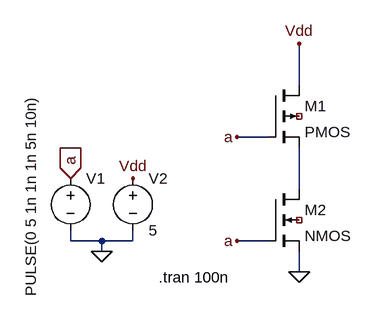
[diagram p0: schematic NOT.asc]
NOT.asc, the LTspice schematic file:
Version 4
SHEET 1 880 680
WIRE 560 64 560 0
WIRE 512 144 464 144
WIRE 560 224 560 160
WIRE 208 304 208 288
WIRE 256 304 208 304
WIRE 304 304 304 288
WIRE 304 304 256 304
WIRE 512 304 464 304
WIRE 256 320 256 304
WIRE 560 352 560 320
FLAG 208 208 a
IOPIN 208 208 In
FLAG 304 208 Vdd
FLAG 256 320 0
FLAG 560 352 0
FLAG 464 144 a
FLAG 464 304 a
FLAG 560 0 Vdd
SYMBOL voltage 208 192 R0
WINDOW 3 -61 -113 VRight 2
SYMATTR InstName V1
SYMATTR Value PULSE(0 5 1n 1n 1n 5n 10n)
SYMBOL voltage 304 192 R0
SYMATTR InstName V2
SYMATTR Value 5
SYMBOL pmos4 512 64 R0
SYMATTR InstName M1
SYMBOL nmos4 512 224 R0
SYMATTR InstName M2
TEXT 344 360 Left 2 !.tran 100n

The netlist it stands for:
* NOT.asc
V1 a 0 PULSE(0 5 1n 1n 1n 5n 10n)
V2 Vdd 0 5
M1 Vdd a N001 NC_01 PMOS
M2 N001 a 0 NC_02 NMOS
.model NMOS NMOS
.model PMOS PMOS
.lib standard.mos
.tran 100n
.backanno
.end